# EAGLE schematic PiDGCv2 (EAGLE 9.6.2)
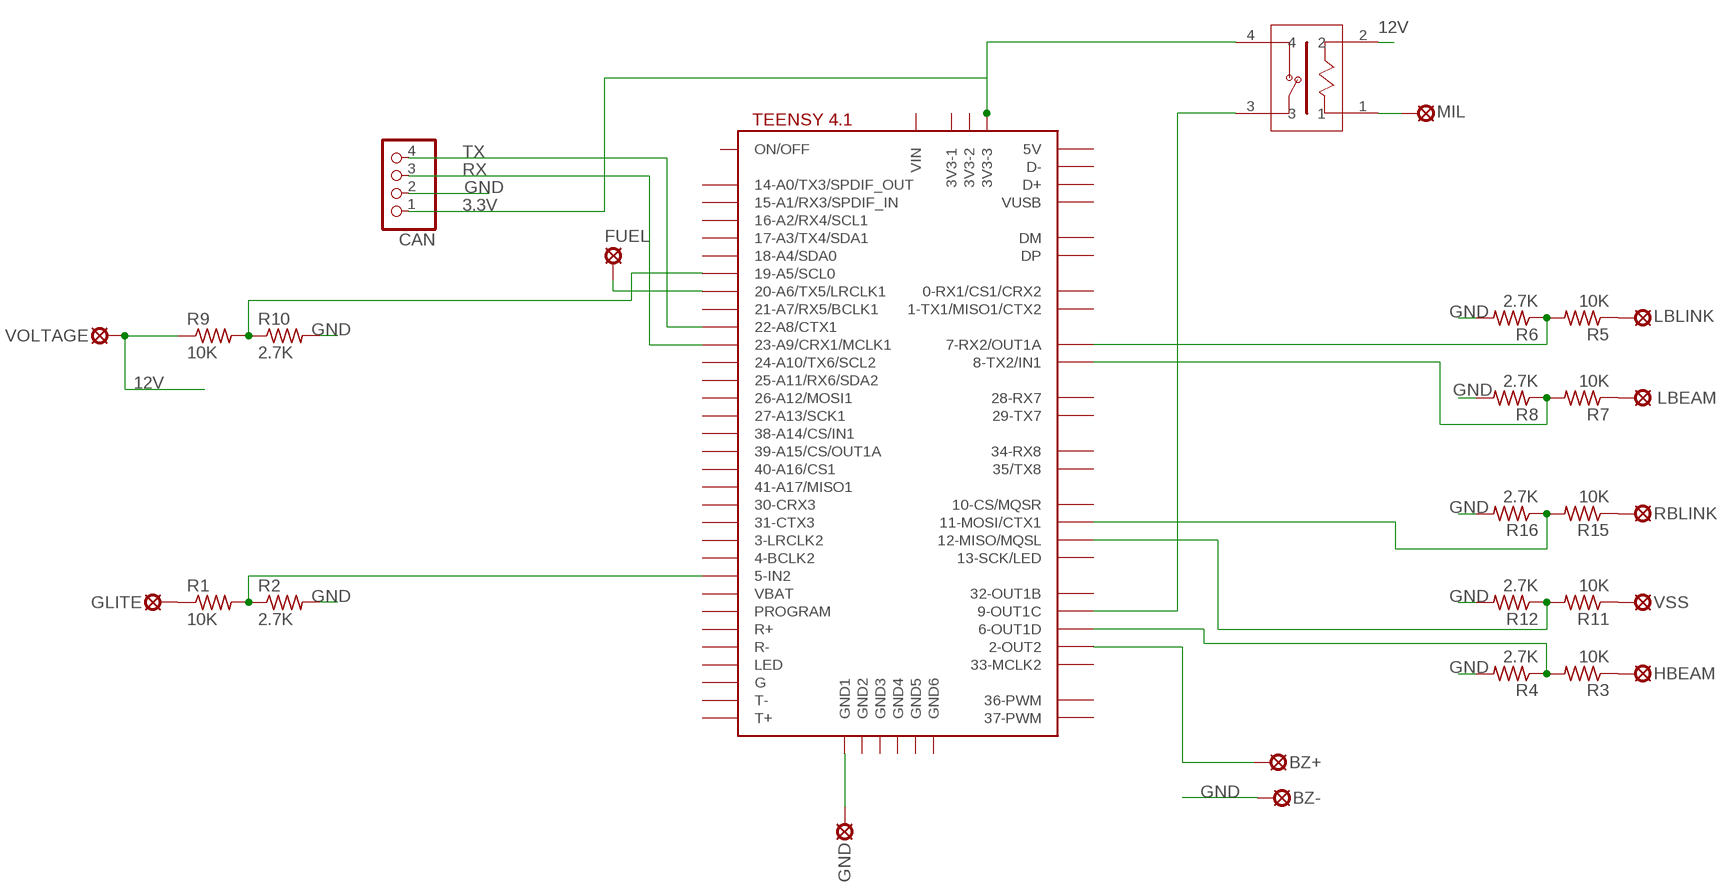
[diagram p0: schematic, sheet 1]

## Parts
BZ+  LSP10  [LSP10]
BZ-  LSP10  [LSP10]
CAN  PINHD-1X4  [1X04]
FUEL  LSP10  [LSP10]
GLITE  LSP10  [LSP10]
GND  LSP10  [LSP10]
HBEAM  LSP10  [LSP10]
LBEAM  LSP10  [LSP10]
LBLINK  LSP10  [LSP10]
MIL  LSP10  [LSP10]
MIL_RELAY  BR-1050-VP  [RELAY]
R1  10K  R-US_0204/7  [0204/7]
R2  2.7K  R-US_0204/7  [0204/7]
R3  10K  R-US_0204/7  [0204/7]
R4  2.7K  R-US_0204/7  [0204/7]
R5  10K  R-US_0204/7  [0204/7]
R6  2.7K  R-US_0204/7  [0204/7]
R7  10K  R-US_0204/7  [0204/7]
R8  2.7K  R-US_0204/7  [0204/7]
R9  10K  R-US_0204/7  [0204/7]
R10  2.7K  R-US_0204/7  [0204/7]
R11  10K  R-US_0204/7  [0204/7]
R12  2.7K  R-US_0204/7  [0204/7]
R15  10K  R-US_0204/7  [0204/7]
R16  2.7K  R-US_0204/7  [0204/7]
RBLINK  LSP10  [LSP10]
U$1  TEENSY41  [TEENSY41]
VOLTAGE  LSP10  [LSP10]
VSS  LSP10  [LSP10]

## Nets
3.3V: CAN.1 MIL_RELAY.4 U$1.3V3-3
12V: MIL_RELAY.2 R9.1 VOLTAGE.MP
GND: BZ-.MP CAN.2 GND.MP R2.2 R4.2 R6.2 R8.2 R10.2 R12.2 R16.2 U$1.GND1
N$1: R3.2 R4.1 U$1.6-OUT1D
N$2: R1.2 R2.1 U$1.5-IN2
N$3: GLITE.MP R1.1
N$4: HBEAM.MP R3.1
N$5: R5.2 R6.1 U$1.7-RX2/OUT1A
N$6: LBLINK.MP R5.1
N$7: R7.2 R8.1 U$1.8-TX2/IN2(8-TX2/IN1)
N$8: LBEAM.MP R7.1
N$9: FUEL.MP U$1.20-A6/TX5/LRCLK1
N$10: R9.2 R10.1 U$1.19-A5/SCL0
N$12: R11.2 R12.1 U$1.12-MISO/MQSL
N$13: R11.1 VSS.MP
N$16: R15.2 R16.1 U$1.11-MOSI/CTX1
N$17: R15.1 RBLINK.MP
N$19: MIL.MP MIL_RELAY.1
N$20: MIL_RELAY.3 U$1.9-OUT1C
N$21: BZ+.MP U$1.2-OUT2
RX: CAN.3 U$1.23-A9/CRX1/MCLK1
TX: CAN.4 U$1.22-A8/CTX1
Unconnected: U$1.0-RX1/CS1/CRX2 U$1.1-TX1/MISO1/CTX2 U$1.3-LRCLK2 U$1.3V3-1 U$1.3V3-2 U$1.4-BCLK2 U$1.10-CS\MQSR(10-CS/MQSR) U$1.13-SCK/LED U$1.14-A0/TX3/SPDIF_OUT U$1.15-A1/RX3/SPDIF_IN U$1.16-A2/RX4/SCL1 U$1.17-A3/TX4/SDA1 U$1.18-A4/SDA0 U$1.21-A7/RX5/BCLK1 U$1.24-A10/TX6/SCL2 U$1.25-A11/RX6/SDA2 U$1.26-A12/MOSI1 U$1.27-A13/SCK1 U$1.28-RX7 U$1.29-TX7 U$1.30-CRX3 U$1.31-CTX3 U$1.32-OUT1B U$1.33-MCLK2 U$1.34-RX8 U$1.35-TX8(35/TX8) U$1.36-PWM U$1.37-PWM U$1.38-A14/CS/IN1 U$1.39-A15/CS/OUT1A U$1.40-A16/CS1 U$1.41-A17/MISO1 U$1.+5V(5V) U$1.D+ U$1.D- U$1.DM U$1.DP U$1.G U$1.GND2 U$1.GND3 U$1.GND4 U$1.GND5 U$1.GND6 U$1.LED U$1.ON/OFF U$1.PROGRAM U$1.R+ U$1.R- U$1.T+ U$1.T- U$1.VBAT U$1.VIN U$1.VUSB

## Library data of the parts
BZ+ BZ- FUEL GLITE GND HBEAM LBEAM LBLINK MIL RBLINK VOLTAGE VSS = solpad:LSP10: SOLDER PAD drill 1.0 mm, distributor Buerklin, 12H555
CAN = pinhead:PINHD-1X4: PIN HEADER
MIL_RELAY = bestar:BR-1050-VP
R1-R12 R15 R16 = rcl:R-US_: RESISTOR, American symbol; SPICEPREFIX: R
U$1 = teensy:TEENSY41